# EAGLE design LiPoDisp (EAGLE 5.07)
BEST: Farnell 1081223
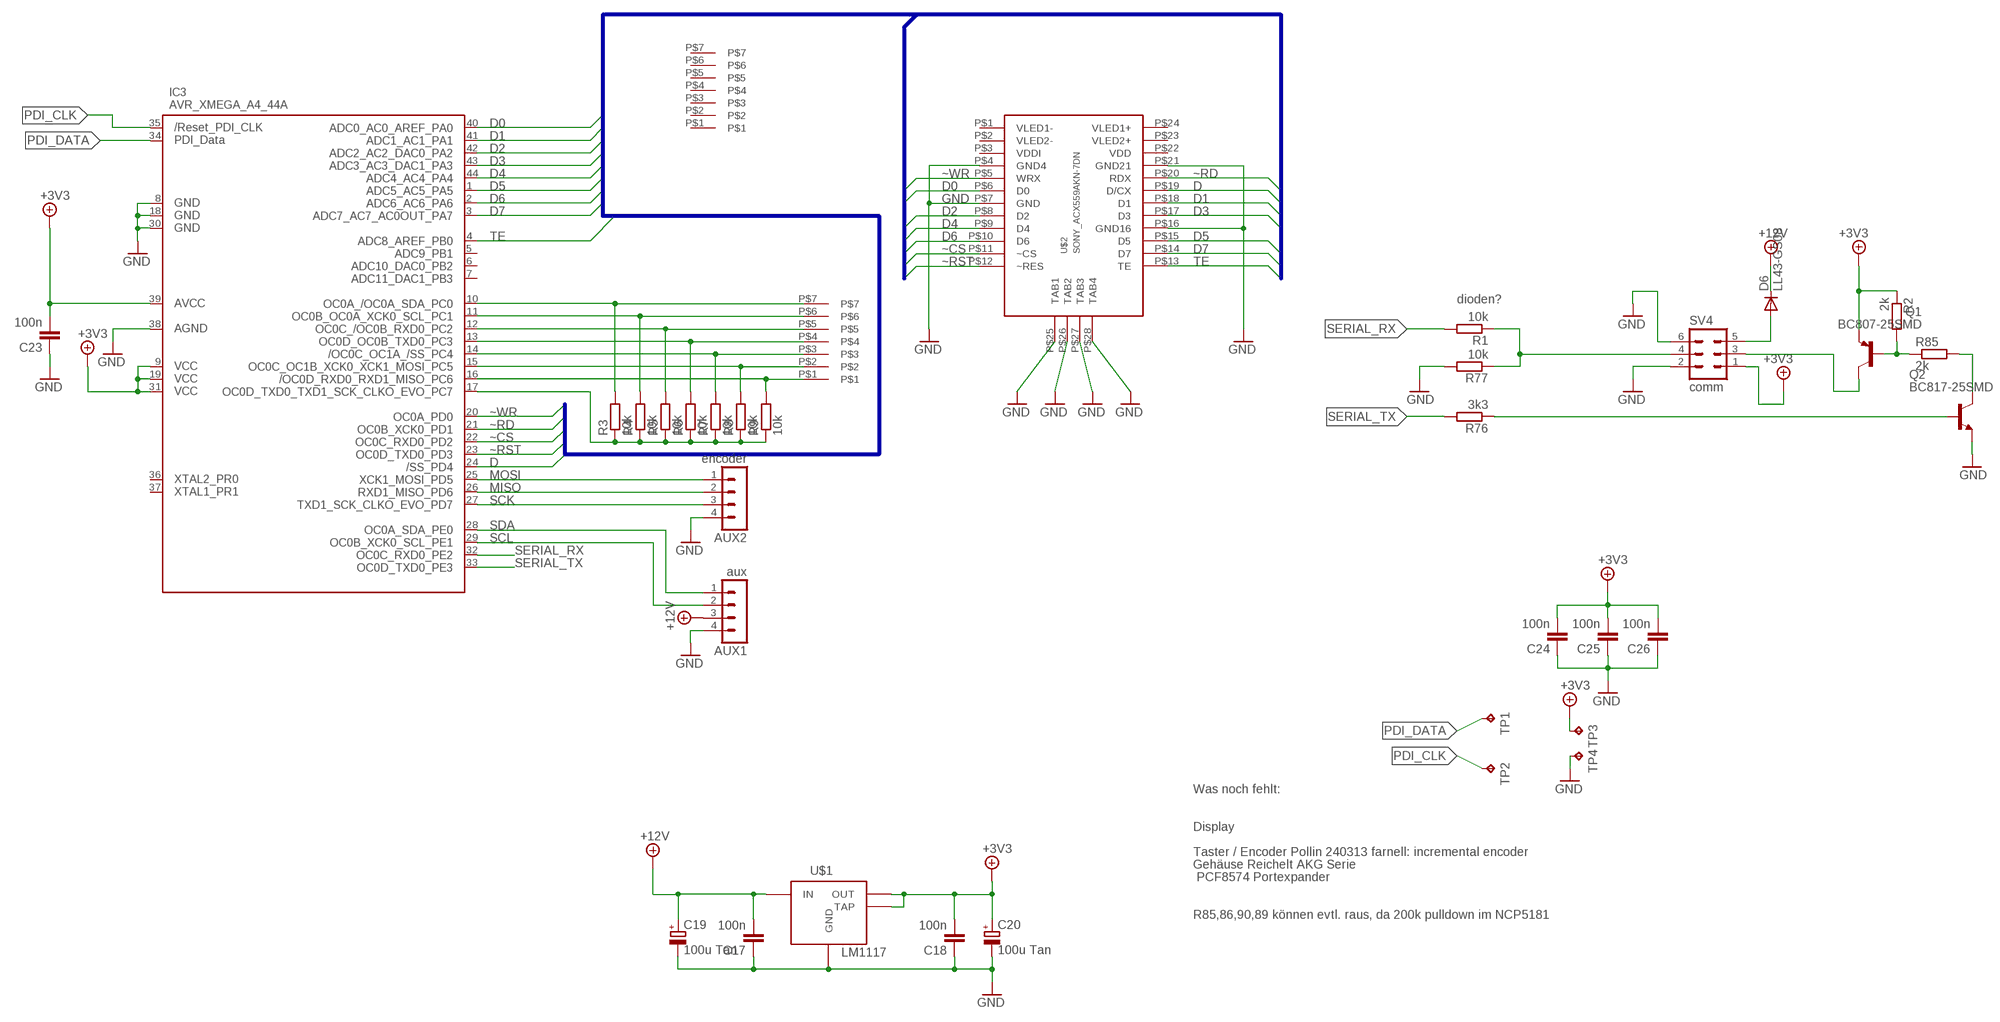
[diagram p0: schematic, sheet 1]

## Parts
AUX1  aux  MA04-1  [MA04-1]
AUX2  encoder  MA04-1  [MA04-1]
C17  100n  C-EUC0603K  [C0603K]
C18  100n  C-EUC0603K  [C0603K]
C19  100u Tan  CPOL-EUSMCC  [SMC_C]
C20  100u Tan  CPOL-EUSMCC  [SMC_C]
C23  100n  C-EUC0603K  [C0603K]
C24  100n  C-EUC0603K  [C0603K]
C25  100n  C-EUC0603K  [C0603K]
C26  100n  C-EUC0603K  [C0603K]
D6  LL43-GS08  DIODE-SOD80C  [SOD80C]
IC3  AVR_XMEGA_A4_44A  [TQFP44]
Q1  BC807-25SMD  [SOT23-BEC]
Q2  BC817-25SMD  [SOT23-BEC]
R1  10k  R-EU_R0603  [R0603]
R2  2k  R-EU_R0603  [R0603]
R3  10k  R-EU_R0603  [R0603]
R4  10k  R-EU_R0603  [R0603]
R5  10k  R-EU_R0603  [R0603]
R6  10k  R-EU_R0603  [R0603]
R7  10k  R-EU_R0603  [R0603]
R8  10k  R-EU_R0603  [R0603]
R9  10k  R-EU_R0603  [R0603]
R76  3k3  R-EU_R0603  [R0603]
R77  10k  R-EU_R0603  [R0603]
R85  2k  R-EU_R0603  [R0603]
SV4  comm  ML6L  [ML6L]
TP1  TPTP15R  [TP15R]
TP2  TPTP15R  [TP15R]
TP3  TPTP15R  [TP15R]
TP4  TPTP15R  [TP15R]
U$1  LM1117  [SOT223]
U$2  SONY_ACX559AKN-7DN  [SONY_ACX559AKN-7_A]
U$3  PAD7PAD  [PAD7]
U$4  PAD7PAD-V  [PAD7V]

## Nets
+3V3 [Lo-Power]: C18.2 C20.+ C23.2 C24.2 C25.2 C26.2 IC3.9(VCC1) IC3.19(VCC2) IC3.31(VCC3) IC3.39(AVCC) Q1.E R2.1 SV4.1 TP3.TP U$1.MID(OUT) U$1.TAP
+12V [Lo-Power]: AUX1.3 C17.2 C19.+ D6.C U$1.RIGHT(IN)
D: IC3.24(PD4) U$2.P$19(D/CX)
D0: IC3.40(PA0) U$2.P$6(D0)
D1: IC3.41(PA1) U$2.P$18(D1)
D2: IC3.42(PA2) U$2.P$8(D2)
D3: IC3.43(PA3) U$2.P$17(D3)
D4: IC3.44(PA4) U$2.P$9(D4)
D5: IC3.1(PA5) U$2.P$15(D5)
D6: IC3.2(PA6) U$2.P$10(D6)
D7: IC3.3(PA7) U$2.P$14(D7)
GND [Lo-Power]: AUX1.4 AUX2.4 C17.1 C18.1 C19.- C20.- C23.1 C24.1 C25.1 C26.1 IC3.8(GND1) IC3.18(GND2) IC3.30(GND3) IC3.38(AGND) Q2.E R77.2 SV4.2 SV4.6 TP4.TP U$1.LEFT(GND) U$2.P$4(GND4) U$2.P$7(GND) U$2.P$16(GND16) U$2.P$21(GND21) U$2.P$25(TAB1) U$2.P$26(TAB2) U$2.P$27(TAB3) U$2.P$28(TAB4)
MISO: AUX2.2 IC3.26(PD6)
MOSI: AUX2.1 IC3.25(PD5)
N$2: Q2.C R85.2
N$3: Q1.C SV4.3
N$4: Q1.B R2.2 R85.1
N$5: IC3.10(PC0) R3.2 U$4.P$7
N$6: IC3.11(PC1) R4.2 U$4.P$6
N$7: IC3.12(PC2) R5.2 U$4.P$5
N$8: IC3.13(PC3) R6.2 U$4.P$4
N$9: IC3.14(PC4) R7.2 U$4.P$3
N$10: Q2.B R76.1
N$11: IC3.15(PC5) R8.2 U$4.P$2
N$12: IC3.16(PC6) R9.2 U$4.P$1
N$13: IC3.17(PC7) R3.1 R4.1 R5.1 R6.1 R7.1 R8.1 R9.1
N$84 [Lo-Power]: D6.A SV4.5
PDI_CLK: IC3.35(RESET) TP2.TP
PDI_DATA: IC3.34(PDI_DATA) TP1.TP
SCK: AUX2.3 IC3.27(PD7)
SCL: AUX1.2 IC3.29(PE1)
SDA: AUX1.1 IC3.28(PE0)
SERIAL_RX: IC3.32(PE2) R1.2
SERIAL_RX_R: R1.1 R77.1 SV4.4
SERIAL_TX: IC3.33(PE3) R76.2
TE: IC3.4(PB0) U$2.P$13(TE)
~CS: IC3.22(PD2) U$2.P$11(~CS)
~RD: IC3.21(PD1) U$2.P$20(RDX)
~RST: IC3.23(PD3) U$2.P$12(~RES)
~WR: IC3.20(PD0) U$2.P$5(WRX)
Unconnected: IC3.5(PB1) IC3.6(PB2) IC3.7(PB3) IC3.36(PR0) IC3.37(PR1) U$2.P$1(VLED1-) U$2.P$2(VLED2-) U$2.P$3(VDDI) U$2.P$22(VDD) U$2.P$23(VLED2+) U$2.P$24(VLED1+) U$3.P$1 U$3.P$2 U$3.P$3 U$3.P$4 U$3.P$5 U$3.P$6 U$3.P$7

## Buses
D[0..7],~WR,~RD,~CS,~RST,D,TE

## Notes on the sheet
- dioden?
- Was noch fehlt:
- Display
- Taster / Encoder Pollin 240313 farnell: incremental encoder
- Gehäuse Reichelt AKG Serie
- PCF8574 Portexpander
- R85,86,90,89 können evtl. raus, da 200k pulldown im NCP5181

## Library data of the parts
AUX1 AUX2 = Fabian:MA04-1: PIN HEADER
C17 C18 C23-C26 = rcl:C-EU: CAPACITOR, European symbol
C19 C20 = rcl:CPOL-EU: POLARIZED CAPACITOR, European symbol
D6 = diode:DIODE-: DIODE
IC3 = xmega:AVR_XMEGA_A4_: Device for Atmel AVR XMEGA A4 Series
Q1 = transistor-pnp:BC807*: PNP Transistror
Q2 = transistor-npn:BC817*: NPN Transistor
R1-R9 R76 R77 R85 = rcl:R-EU_: RESISTOR, European symbol
SV4 = con-harting-ml:ML6: HARTING
TP1-TP4 = testpad:TP: Test pad
U$1 = Fabian:LM1117: lm1117 from National semi, buy from onlinecomponents.com add at least 10 uF at output Order No: LM1117MP-3.3
U$2 = Fabian:SONY_ACX559AKN-7: SONY ACX559AKN-7 full Color display matching connector JST-JAN 24R-JANK-GSAN-TF
U$3 U$4 = Fabian:PAD7

## Net classes
0 default: width 0.2 mm
1 Hi-Power: width 0.3 mm
2 Lo-Power: width 0.3 mm
3 Iso-bus: clearance 0.6 mm to class 0, clearance 0.6 mm to class 1, clearance 0.6 mm to class 2

## Board
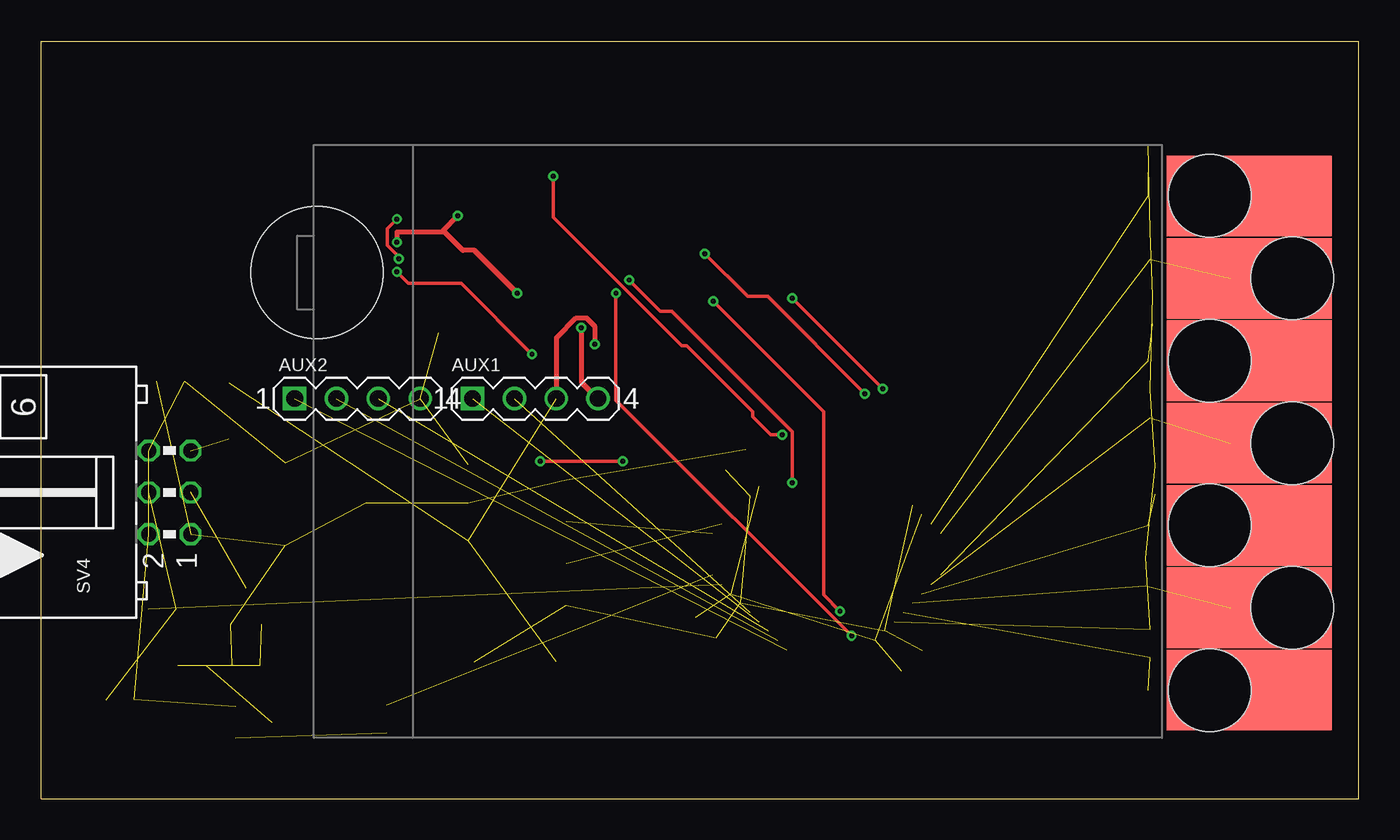
[diagram p1: board, top side]
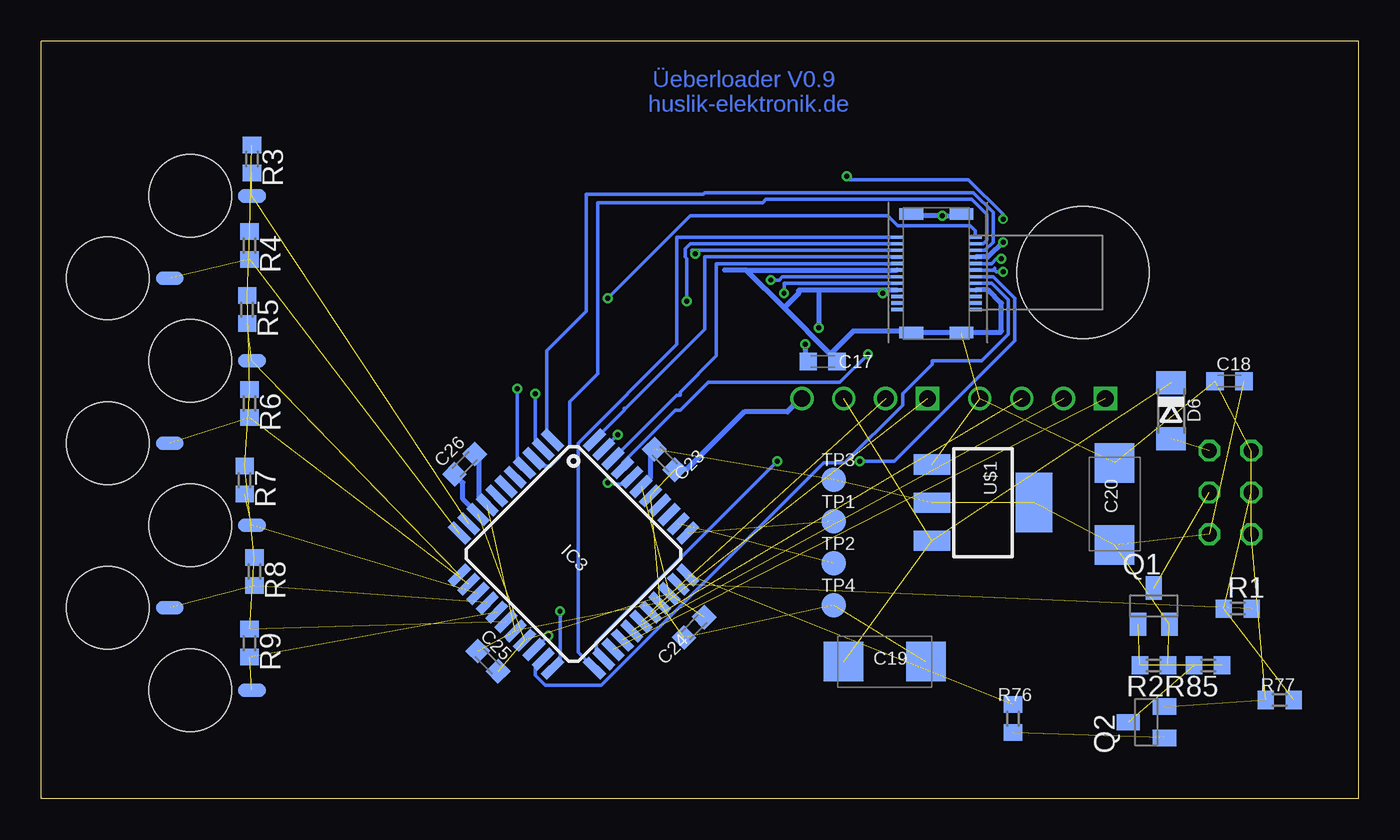
[diagram p2: board, bottom side, seen from below]

Size 80 x 46 mm. Coordinates in mm from the lower left corner, seen from the top.
Outline: 0,0 80,0 80,46 0,46 0,0
Copper layers (1*16): Top 0.035mm / dielectric 1.5mm / Bottom 0.035mm
Design rules "Fischer-LP *": minimum track width 0.15mm, minimum drill 0.3mm, track to track 0.15mm, track to pad 0.15mm, pad to pad 0.15mm, via to via 0.15mm, smd to smd 0mil, copper to edge 0.2mm, drill to drill 0.3mm, minimum pad ring 0.2mm, minimum via ring 0.15mm, stop-mask expansion 0.1mm, vias tented up to drill 0.5mm, thermal gap 0.15mm

### Footprints (pad centres in the part's own frame; a part is rotated, then mirrored left to right if it is on the bottom)
MA04-1 = drill 1.016 square: 1 -3.81,0 | drill 1.016 round: 2 -1.27,0; 3 1.27,0; 4 3.81,0
C0603K = smd 1.05 x 1.08: 1 -0.875,0; 2 0.875,0
SMC_C = smd 2.4 x 2.4: + -2.5,0; - 2.5,0
SOD80C = smd 1.4 x 1.8: A 1.7,0; C -1.7,0
TQFP44 = smd 1.5 x 0.5: 1 -5.8,4; 2 -5.8,3.2; 3 -5.8,2.4; 4 -5.8,1.6; 5 -5.8,0.8; 6 -5.8,0; 7 -5.8,-0.8; 8 -5.8,-1.6; 9 -5.8,-2.4; 10 -5.8,-3.2; 11 -5.8,-4; 23 5.8,-4; 24 5.8,-3.2; 25 5.8,-2.4; 26 5.8,-1.6; 27 5.8,-0.8; 28 5.8,0; 29 5.8,0.8; 30 5.8,1.6; 31 5.8,2.4; 32 5.8,3.2; 33 5.8,4 | smd 0.5 x 1.5: 12 -4,-5.8; 13 -3.2,-5.8; 14 -2.4,-5.8; 15 -1.6,-5.8; 16 -0.8,-5.8; 17 0,-5.8; 18 0.8,-5.8; 19 1.6,-5.8; 20 2.4,-5.8; 21 3.2,-5.8; 22 4,-5.8; 34 4,5.8; 35 3.2,5.8; 36 2.4,5.8; 37 1.6,5.8; 38 0.8,5.8; 39 0,5.8; 40 -0.8,5.8; 41 -1.6,5.8; 42 -2.4,5.8; 43 -3.2,5.8; 44 -4,5.8
SOT23-BEC = smd 1 x 1.4: B -0.95,-1.1; C 0,1.1; E 0.95,-1.1
R0603 = smd 1 x 1.1: 1 -0.85,0; 2 0.85,0
ML6L = drill 0.914 octagon: 1 -2.54,-1.27; 2 -2.54,1.27; 3 0,-1.27; 4 0,1.27; 5 2.54,-1.27; 6 2.54,1.27
TP15R = smd 1.5 x 1.5: TP 0,0
SOT223 = smd 1.219 x 2.235: LEFT -2.311,-3.099; MID 0,-3.099; RIGHT 2.311,-3.099 | smd 3.6 x 2.2: TAP 0,3.099
SONY_ACX559AKN-7_A = smd 0.2 x 0.7: P$1 0,0; P$2 0.4,0; P$3 0.8,0; P$4 1.2,0; P$5 1.6,0; P$6 2,0; P$7 2.4,0; P$8 2.8,0; P$9 3.2,0; P$10 3.6,0; P$11 4,0; P$12 4.4,0; P$13 4.4,-4.8; P$14 4,-4.8; P$15 3.6,-4.8; P$16 3.2,-4.8; P$17 2.8,-4.8; P$18 2.4,-4.8; P$19 2,-4.8; P$20 1.6,-4.8; P$21 1.2,-4.8; P$22 0.8,-4.8; P$23 0.4,-4.8; P$24 0,-4.8 | smd 0.7 x 1.45: P$25 5.8,-0.875; P$26 5.8,-3.925; P$27 -1.4,-3.925; P$28 -1.4,-0.875 | hole 8: 2.25,-11.3
PAD7 = smd 4.9 x 10: P$1 0,0; P$2 5,0; P$3 10,0; P$4 15,0; P$5 20,0; P$6 25,0; P$7 30,0
PAD7V = smd 0.813 x 1.676: P$1 0,-3.75; P$2 5,1.25; P$3 10,-3.75; P$4 15,1.25; P$5 20,-3.75; P$6 25,1.25; P$7 30,-3.75 | hole 5: 0,0; 5,5; 10,0; 15,5; 20,0; 25,5; 30,0

### Placement (x,y rotation side)
AUX1  30,24.3 0 top
AUX2  19.2,24.3 0 top
C17  32.55,26.55 180 bottom
C18  7.85,25.36 0 bottom
C19  28.78,8.33 0 bottom
C20  14.83,17.9 90 bottom
C23  42.15,20.61 135 bottom
C24  40.36,10.41 45 bottom
C25  52.88,8.36 315 bottom
C26  54.29,20.32 225 bottom
D6  11.4,23.55 270 bottom
IC3  47.68,14.86 315 bottom
Q1  12.45,11.7 0 bottom
Q2  12.9,4.65 90 bottom
R1  7.35,11.55 0 bottom
R2  12.45,8.1 180 bottom
R3  67.2,38.85 270 bottom
R4  67.35,33.6 270 bottom
R5  67.5,29.7 270 bottom
R6  67.35,24 270 bottom
R7  67.65,19.35 270 bottom
R8  67.05,13.8 270 bottom
R9  67.35,9.45 270 bottom
R76  21,4.87 90 bottom
R77  4.8,6 180 bottom
R85  9.15,8.1 180 bottom
SV4  7.8,18.6 90 top
TP1  31.89,16.84 0 bottom
TP2  31.89,14.3 0 bottom
TP3  31.89,19.39 0 bottom
TP4  31.89,11.77 0 bottom
U$1  22.82,17.98 270 bottom
U$2  28.05,29.7 90 bottom
U$3  73.35,6.6 90 top
U$4  70.95,6.6 90 bottom

### Tracks (layer width: path | path; a pad name or v marks a point on that pad's centre or on a via)
+3V3  (13 unrouted)
  Bottom 0.3: C26.2 54.4,19.2 54.4,18.2 53.5,17.3 IC3.9 | C23.2 42.8,21.2 43,21 43,19.5 43.5,19 IC3.39
+12V  (via drill 0.3)  (3 unrouted)
  Top 0.3: v33.6,27.6 33.6,28.7 33.1,29.2 32.5,29.2 31.3,28 31.3,24.3 AUX1.3
  Bottom 0.3: v33.6,27.6 33.6,26.7 33.5,26.6 C17.2
D  (via drill 0.3)
  Top 0.2: v30.3,20.5 v35.3,20.5
  Bottom 0.2: IC3.24 45.9,8.5 46.3,8.9 46.3,9.5 v35.3,20.5 | U$2.P$19 22.2,31.7 20.9,30.4 20.9,27.8 28.2,20.5 v30.3,20.5
D0  (via drill 0.3)
  Top 0.2: v45.6,19.2 45.6,22.3 38.3,29.6 37.6,29.6 v35.7,31.5
  Bottom 0.2: v45.6,19.2 45.3,19.2 45.2,19.1 44.6,19.1 44.2,19.5 IC3.40 | v35.7,31.5 35.2,31.5 35,31.7 U$2.P$6
D1  (via drill 0.3)
  Top 0.2: 21.5,32.1 v21.6,32 22.3,31.3 25.5,31.3 v29.8,27
  Bottom 0.2: v29.8,27 31.5,25.3 39.5,25.3 41.2,23.6 41.5,23.6 44.7,20.4 IC3.41 44.8,20 | 22.15,32.15 22.2,32.1 U$2.P$18 | 22.15,32.15 22.1,32.2 | v21.6,32 22,32 22.15,32.15
D2
  Bottom 0.2: U$2.P$8 39,32.5 39,26.9 41.2,24.7 41.2,24.5 41.4,24.5 45.2,20.7 IC3.42
D3  (via drill 0.3)
  Top 0.2: v31.1,37.8 31.1,35.3 38.9,27.5 39.2,27.5 43.2,23.5 43.2,23.2 44.3,22.1 v45,22.1 | v21.7,32.8 21.7,32.9 21,33.6 21,34.6 v21.6,35.2
  Bottom 0.2: v31.1,37.8 30.9,37.6 23.7,37.6 21.6,35.5 v21.6,35.2 | v45,22.1 45.8,21.3 IC3.43 | U$2.P$17 22.3,32.5 22,32.8 v21.7,32.8
D4
  Bottom 0.2: U$2.P$9 39.7,32.9 39.7,28.5 44.5,23.7 44.6,23.7 44.6,23.6 IC3.44
D5
  Bottom 0.2: IC3.1 49,21.8 49.3,22.1 49.3,27.2 46.9,29.6 46.9,36.7 39.8,36.7 39.7,36.8 23.4,36.8 22.2,35.6 22.2,33.8 22.7,33.3 U$2.P$15
D6  (via drill 0.3)
  Top 0.2: v40.3,33.1 42.9,30.5 44.1,30.5 v50,24.6
  Bottom 0.2: U$2.P$10 40.5,33.3 v40.3,33.1 | IC3.2 49.6,21.3 50,21.7 v50,24.6
D7
  Bottom 0.2: U$2.P$14 22.8,33.7 22.6,33.9 22.6,35.5 23.5,36.4 36,36.4 36.2,36.2 46.2,36.2 46.2,25.8 47.9,24.1 47.9,21.4 49.1,20.2 49.6,20.2 50,20.6 IC3.3
GND  (via drill 0.3)  (16 unrouted)
  Top 0.3: v32.8,28.6 32.8,25.3 AUX1.4 | v21.6,33.8 21.6,34.4 24.3,34.4 24.4,34.5 | 24.4,34.5 v25.3,35.4 | v28.9,30.7 26.3,33.3 25.6,33.3 24.4,34.5
  Bottom 0.3: 37.2,32.1 U$2.P$7 | 37.2,32.1 38.5,32.1 | 32.1,27 34.9,29.8 | 32.1,27 31.7,26.6 C17.1 | 34.9,29.8 37.2,32.1 | 32.8,30.9 34,30.9 34,30.7 34.9,29.8 | 32.8,30.9 28.9,30.9 | 28.9,30.9 U$2.P$4 | 32.8,30.9 v32.8,28.6 | 32.1,27 30.7,28.4 27.3,28.4 27.2,28.3 U$2.P$28 U$2.P$27 21.8,28.3 21.7,28.4 21.7,30.1 22.5,30.9 U$2.P$21 | v21.6,33.8 22.5,32.9 U$2.P$16 | U$2.P$26 24.2,35.5 24.3,35.4 v25.3,35.4 27,35.4 27.1,35.5 U$2.P$25 | 28.9,30.9 v28.9,30.7 | AUX1.4 33.9,24.3 34.7,23.5 37.3,23.5 40.8,20 41.5,20 C23.1 | IC3.8 53,17.9 53.4,18.3 53.4,20.7 53.6,20.9 C26.1
MISO  (1 unrouted)
MOSI  (1 unrouted)
N$2  (1 unrouted)
N$3  (1 unrouted)
N$4  (2 unrouted)
N$5  (2 unrouted)
N$6  (2 unrouted)
N$7  (2 unrouted)
N$8  (2 unrouted)
N$9  (2 unrouted)
N$10  (1 unrouted)
N$11  (2 unrouted)
N$12  (2 unrouted)
N$13  (7 unrouted)
N$84  (1 unrouted)
PDI_CLK  (1 unrouted)
PDI_DATA  (1 unrouted)
SCK  (1 unrouted)
SCL  (1 unrouted)
SDA  (1 unrouted)
SERIAL_RX  (1 unrouted)
SERIAL_RX_R  (2 unrouted)
SERIAL_TX  (1 unrouted)
TE  (via drill 0.3)
  Top 0.2: v45.6,30.4 v51.1,24.9
  Bottom 0.2: U$2.P$13 23.3,34.1 23.3,34.5 23.6,34.8 28,34.8 28.6,35.4 40.6,35.4 v45.6,30.4 | v51.1,24.9 51.1,20.5 50.7,20.1 IC3.4
~CS  (via drill 0.3)
  Top 0.2: v40.8,30.2 47.5,23.5 47.5,12.4 v48.5,11.4
  Bottom 0.2: v40.8,30.2 40.8,32.8 40.9,32.9 40.9,33.4 40.6,33.7 U$2.P$11 | v48.5,11.4 48.5,8.4 48.9,8 IC3.22
~RD
  Bottom 0.2: U$2.P$20 22.3,31.3 21.3,30.3 21.3,28.2 22.9,26.6 25.9,26.6 25.9,26.4 27.7,24.6 27.7,23.9 31.2,20.4 32.5,20.4 46,6.9 49.4,6.9 50,7.5 50,8 49.6,8.4 IC3.21
~RST
  Bottom 0.2: U$2.P$12 41.4,34.1 41.4,27.6 47.4,21.6 47.4,8.9 46.5,8 IC3.23
~WR  (via drill 0.3)
  Top 0.2: v34.9,30.7 34.9,24.2 v49.2,9.9
  Bottom 0.2: U$2.P$5 34.9,31.3 v34.9,30.7 | v49.2,9.9 50,9.1 IC3.20

### Text on the board
Bottom: Üeberloader V0.9 | huslik-elektronik.de